# Altium schematic sheet DIOT_CONN.SchDoc
size A3; SheetNumber: 2; SheetTotal: 7
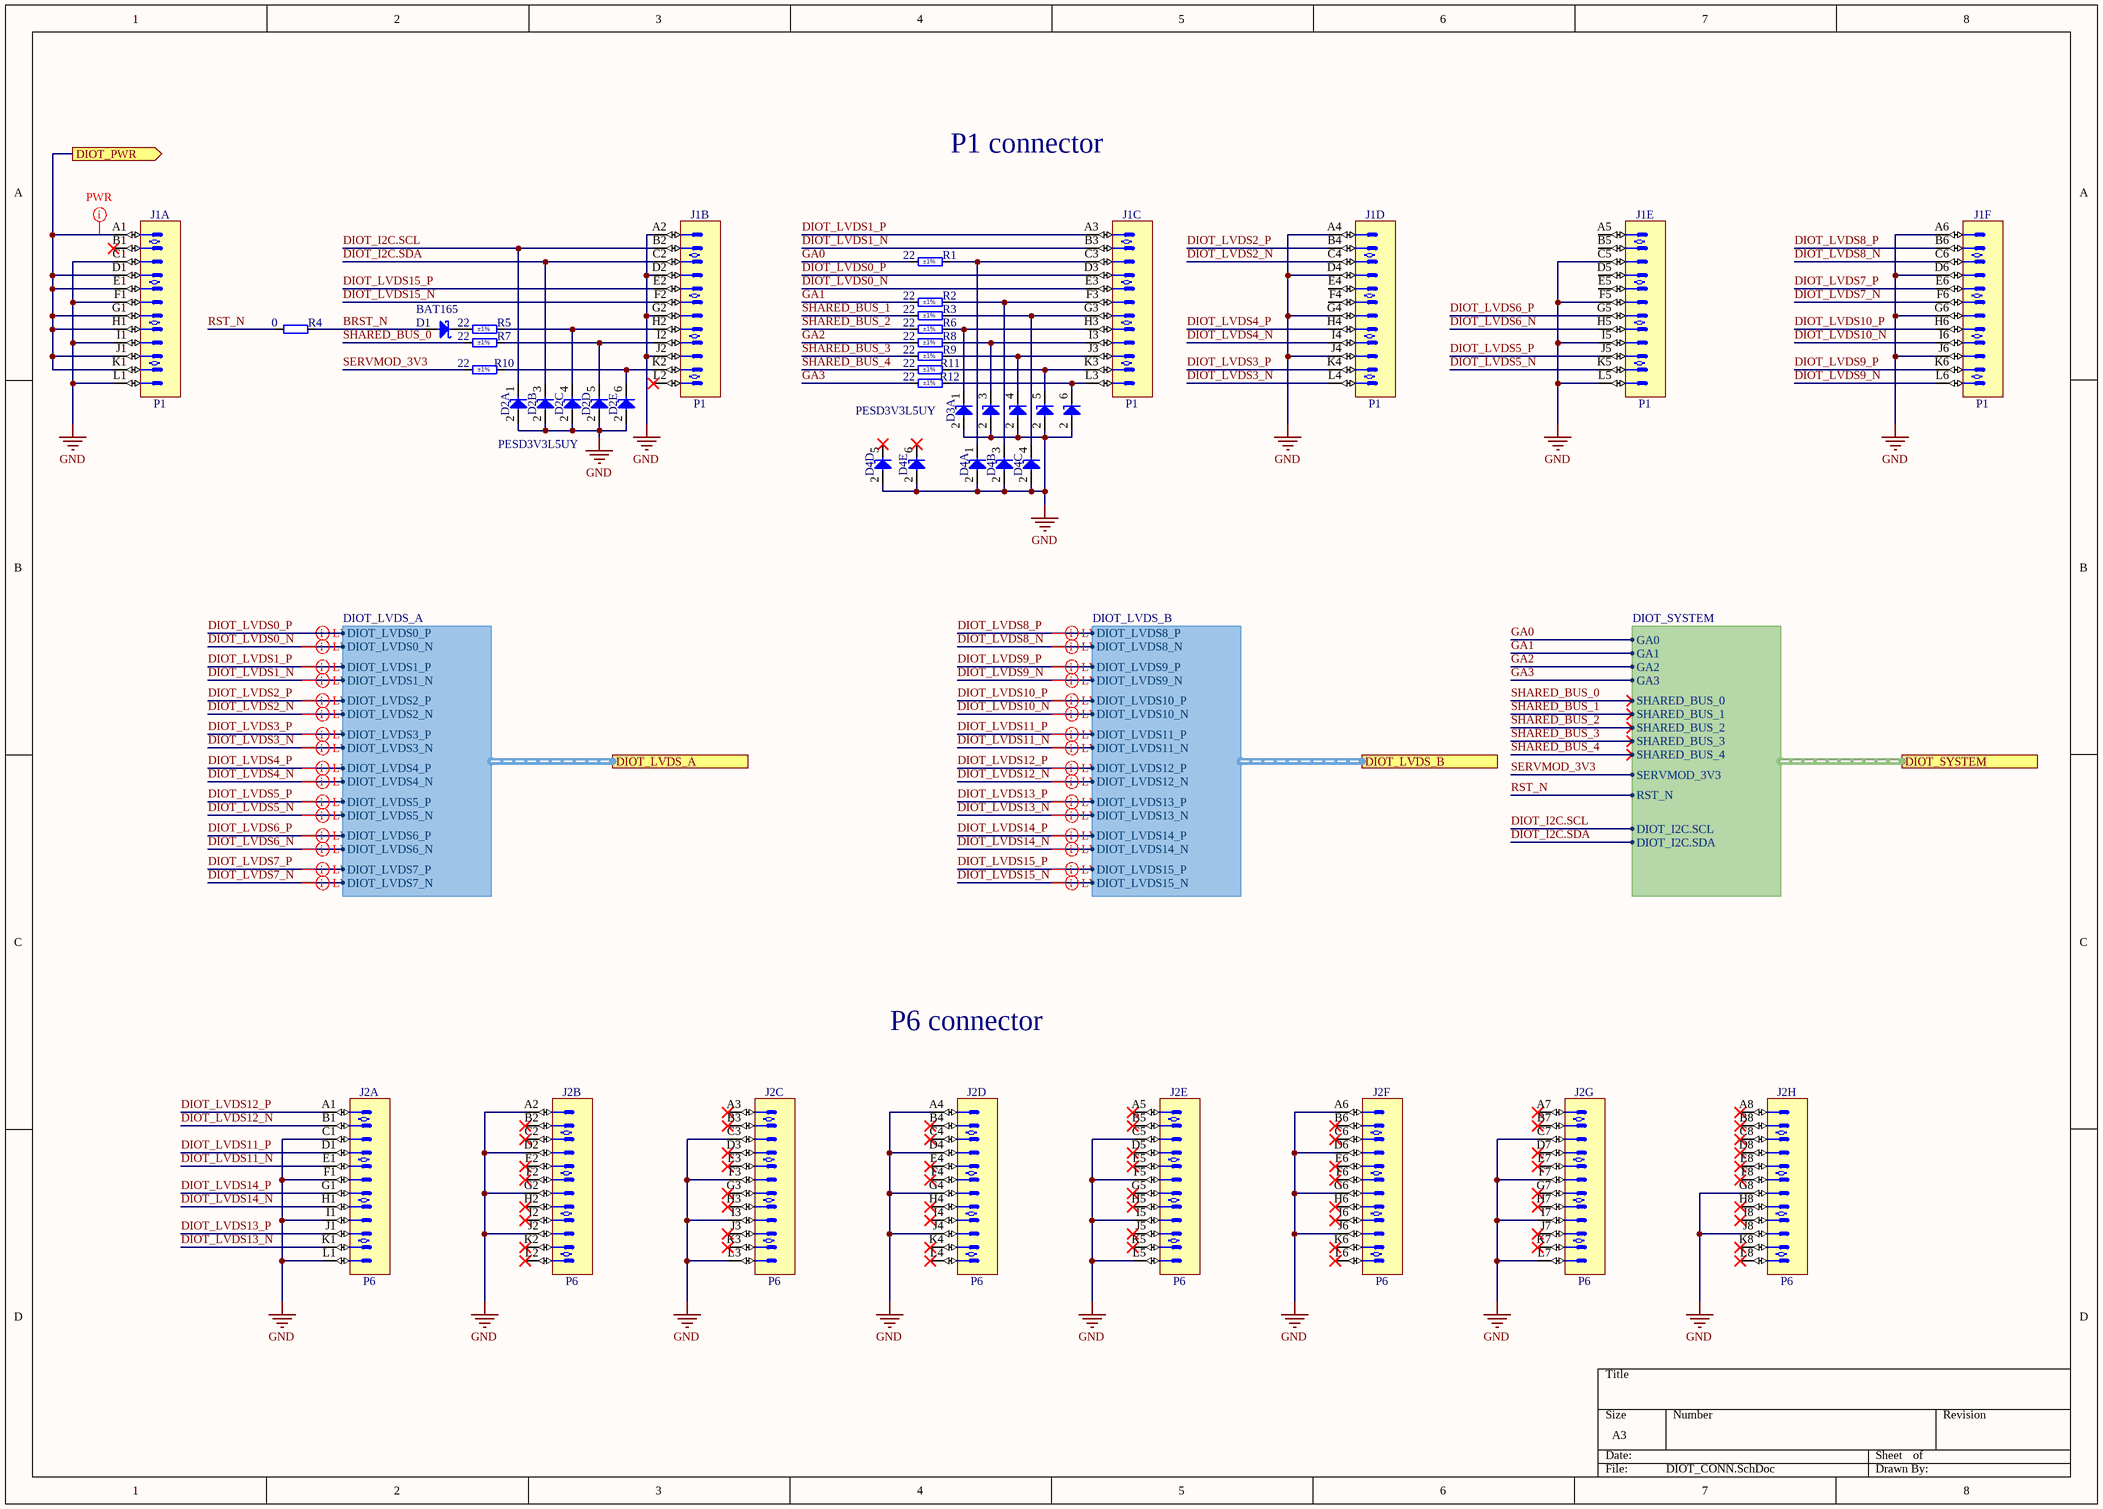
[diagram p0: DIOT_CONN.SchDoc]

## Parts
D1  BAT165  [SOD2512X110N]
D2  PESD3V3L5UY  [SOT65P210X110-6N]  (parts A,B,C,D,E of 5)
D3  PESD3V3L5UY  [SOT65P210X110-6N]  (parts A,B,C,D,E of 5)
D4  PESD3V3L5UY  [SOT65P210X110-6N]  (value not drawn)  (parts A,B,C,D,E of 5)
J1  P1  [AMPHENOL_10052825-101LF]  (parts A,B,C,D,E,F of 6)
J2  P6  [AMPHENOL_10052838-101LF]  (parts A,B,C,D,E,F,G,H of 8)
R1  22  Tolerance: ±1%  [RESC1005X40N]
R2  22  Tolerance: ±1%  [RESC1005X40N]
R3  22  Tolerance: ±1%  [RESC1005X40N]
R4  0  [RESC1005X40N]
R5  22  Tolerance: ±1%  [RESC1005X40N]
R6  22  Tolerance: ±1%  [RESC1005X40N]
R7  22  Tolerance: ±1%  [RESC1005X40N]
R8  22  Tolerance: ±1%  [RESC1005X40N]
R9  22  Tolerance: ±1%  [RESC1005X40N]
R10  22  Tolerance: ±1%  [RESC1005X40N]
R11  22  Tolerance: ±1%  [RESC1005X40N]
R12  22  Tolerance: ±1%  [RESC1005X40N]

## Ports
DIOT_LVDS_A (harness DIOT_LVDS_A, see BLOCK_DIAGRAM[6A], REDRIVERS[1A]), DIOT_LVDS_B (harness DIOT_LVDS_B, see BLOCK_DIAGRAM[6A], REDRIVERS[1B]), DIOT_PWR (out, see BLOCK_DIAGRAM[6B], PSU[1A], PSU[1D]), DIOT_SYSTEM (harness DIOT_SYSTEM, see BLOCK_DIAGRAM[7B], SYSTEM[1A])

## Harnesses
DIOT_SYSTEM: GA0, GA1, GA2, GA3, SHARED_BUS_0, SHARED_BUS_1, SHARED_BUS_2, SHARED_BUS_3, SHARED_BUS_4, SERVMOD_3V3, RST_N, DIOT_I2C.SCL, DIOT_I2C.SDA
DIOT_LVDS_A: DIOT_LVDS0_P, DIOT_LVDS0_N, DIOT_LVDS1_P, DIOT_LVDS1_N, DIOT_LVDS2_P, DIOT_LVDS2_N, DIOT_LVDS3_P, DIOT_LVDS3_N, DIOT_LVDS4_P, DIOT_LVDS4_N, DIOT_LVDS5_P, DIOT_LVDS5_N, DIOT_LVDS6_P, DIOT_LVDS6_N, DIOT_LVDS7_P, DIOT_LVDS7_N
DIOT_LVDS_B: DIOT_LVDS8_P, DIOT_LVDS8_N, DIOT_LVDS9_P, DIOT_LVDS9_N, DIOT_LVDS10_P, DIOT_LVDS10_N, DIOT_LVDS11_P, DIOT_LVDS11_N, DIOT_LVDS12_P, DIOT_LVDS12_N, DIOT_LVDS13_P, DIOT_LVDS13_N, DIOT_LVDS14_P, DIOT_LVDS14_N, DIOT_LVDS15_P, DIOT_LVDS15_N

## Nets
GND: D2.2(A) D3.2(A) D4.2(A) J1.A2 J1.A4 J1.A6 J1.C1 J1.C5 J1.D2 J1.D4 J1.D6 J1.F1 J1.F5 J1.G2 J1.G4 J1.G6 J1.I1 J1.I5 J1.J2 J1.J4 J1.J6 J1.L1 J1.L5 J2.A2 J2.A4 J2.A6 J2.C1 J2.C3 J2.C5 J2.C7 J2.D2 J2.D4 J2.D6 J2.F1 J2.F3 J2.F5 J2.F7 J2.G2 J2.G4 J2.G6 J2.G8 J2.I1 J2.I3 J2.I5 J2.I7 J2.J2 J2.J4 J2.J6 J2.J8 J2.L1 J2.L3 J2.L5 J2.L7
BRST_N: D1.2(A) R4.2
DIOT_I2C.SCL: D2.1(C) J1.B2 ; port DIOT_SYSTEM.DIOT_I2C.SCL
DIOT_I2C.SDA: D2.3(C) J1.C2 ; port DIOT_SYSTEM.DIOT_I2C.SDA
DIOT_LVDS0_N: J1.E3 ; port DIOT_LVDS_A.DIOT_LVDS0_N
DIOT_LVDS0_P: J1.D3 ; port DIOT_LVDS_A.DIOT_LVDS0_P
DIOT_LVDS1_N: J1.B3 ; port DIOT_LVDS_A.DIOT_LVDS1_N
DIOT_LVDS1_P: J1.A3 ; port DIOT_LVDS_A.DIOT_LVDS1_P
DIOT_LVDS2_N: J1.C4 ; port DIOT_LVDS_A.DIOT_LVDS2_N
DIOT_LVDS2_P: J1.B4 ; port DIOT_LVDS_A.DIOT_LVDS2_P
DIOT_LVDS3_N: J1.L4 ; port DIOT_LVDS_A.DIOT_LVDS3_N
DIOT_LVDS3_P: J1.K4 ; port DIOT_LVDS_A.DIOT_LVDS3_P
DIOT_LVDS4_N: J1.I4 ; port DIOT_LVDS_A.DIOT_LVDS4_N
DIOT_LVDS4_P: J1.H4 ; port DIOT_LVDS_A.DIOT_LVDS4_P
DIOT_LVDS5_N: J1.K5 ; port DIOT_LVDS_A.DIOT_LVDS5_N
DIOT_LVDS5_P: J1.J5 ; port DIOT_LVDS_A.DIOT_LVDS5_P
DIOT_LVDS6_N: J1.H5 ; port DIOT_LVDS_A.DIOT_LVDS6_N
DIOT_LVDS6_P: J1.G5 ; port DIOT_LVDS_A.DIOT_LVDS6_P
DIOT_LVDS7_N: J1.F6 ; port DIOT_LVDS_A.DIOT_LVDS7_N
DIOT_LVDS7_P: J1.E6 ; port DIOT_LVDS_A.DIOT_LVDS7_P
DIOT_LVDS8_N: J1.C6 ; port DIOT_LVDS_B.DIOT_LVDS8_N
DIOT_LVDS8_P: J1.B6 ; port DIOT_LVDS_B.DIOT_LVDS8_P
DIOT_LVDS9_N: J1.L6 ; port DIOT_LVDS_B.DIOT_LVDS9_N
DIOT_LVDS9_P: J1.K6 ; port DIOT_LVDS_B.DIOT_LVDS9_P
DIOT_LVDS10_N: J1.I6 ; port DIOT_LVDS_B.DIOT_LVDS10_N
DIOT_LVDS10_P: J1.H6 ; port DIOT_LVDS_B.DIOT_LVDS10_P
DIOT_LVDS11_N: J2.E1 ; port DIOT_LVDS_B.DIOT_LVDS11_N
DIOT_LVDS11_P: J2.D1 ; port DIOT_LVDS_B.DIOT_LVDS11_P
DIOT_LVDS12_N: J2.B1 ; port DIOT_LVDS_B.DIOT_LVDS12_N
DIOT_LVDS12_P: J2.A1 ; port DIOT_LVDS_B.DIOT_LVDS12_P
DIOT_LVDS13_N: J2.K1 ; port DIOT_LVDS_B.DIOT_LVDS13_N
DIOT_LVDS13_P: J2.J1 ; port DIOT_LVDS_B.DIOT_LVDS13_P
DIOT_LVDS14_N: J2.H1 ; port DIOT_LVDS_B.DIOT_LVDS14_N
DIOT_LVDS14_P: J2.G1 ; port DIOT_LVDS_B.DIOT_LVDS14_P
DIOT_LVDS15_N: J1.F2 ; port DIOT_LVDS_B.DIOT_LVDS15_N
DIOT_LVDS15_P: J1.E2 ; port DIOT_LVDS_B.DIOT_LVDS15_P
DIOT_PWR: J1.A1 J1.D1 J1.E1 J1.G1 J1.H1 J1.J1 J1.K1 ; port DIOT_PWR
GA0: R1.1 ; port DIOT_SYSTEM.GA0
GA1: R2.1 ; port DIOT_SYSTEM.GA1
GA2: R8.1 ; port DIOT_SYSTEM.GA2
GA3: R12.1 ; port DIOT_SYSTEM.GA3
RST_N: R4.1 ; port DIOT_SYSTEM.RST_N
SERVMOD_3V3: R10.1 ; port DIOT_SYSTEM.SERVMOD_3V3
SHARED_BUS_0: R7.1 ; port DIOT_SYSTEM.SHARED_BUS_0
SHARED_BUS_1: R3.1 ; port DIOT_SYSTEM.SHARED_BUS_1
SHARED_BUS_2: R6.1 ; port DIOT_SYSTEM.SHARED_BUS_2
SHARED_BUS_3: R9.1 ; port DIOT_SYSTEM.SHARED_BUS_3
SHARED_BUS_4: R11.1 ; port DIOT_SYSTEM.SHARED_BUS_4
NetD1_1: D1.1(C) R5.1
NetD2_4: D2.4(C) J1.H2 R5.2
NetD2_5: D2.5(C) J1.I2 R7.2
NetD2_6: D2.6(C) J1.K2 R10.2
NetD3_1: D3.1(C) J1.H3 R6.2
NetD3_3: D3.3(C) J1.I3 R8.2
NetD3_4: D3.4(C) J1.J3 R9.2
NetD3_5: D3.5(C) J1.K3 R11.2
NetD3_6: D3.6(C) J1.L3 R12.2
NetD4_1: D4.1(C) J1.C3 R1.2
NetD4_3: D4.3(C) J1.F3 R2.2
NetD4_4: D4.4(C) J1.G3 R3.2

Not connected (* = marked no-connect by the designer): D4 5(C)* 6(C)*; J1 A5 B1* B5 D5 E4 E5 F4 L2*; J2 A3* A5* A7* A8* B2* B3* B4* B5* B6* B7* B8* C2* C4* C6* C8* D3* D5* D7* D8* E2* E3* E4* E5* E6* E7* E8* F2* F4* F6* F8* G3* G5* G7* H2* H3* H4* H5* H6* H7* H8* I2* I4* I6* I8* J3* J5* J7* K2* K3* K4* K5* K6* K7* K8* L2* L4* L6* L8*

## Layout directives
net class PWR: DIOT_PWR
differential pair; net class LVDS; differential pair class LVDS_DIFF: DIOT_LVDS0_N, DIOT_LVDS0_P, DIOT_LVDS1_N, DIOT_LVDS1_P, DIOT_LVDS2_N, DIOT_LVDS2_P, DIOT_LVDS3_N, DIOT_LVDS3_P, DIOT_LVDS4_N, DIOT_LVDS4_P, DIOT_LVDS5_N, DIOT_LVDS5_P, DIOT_LVDS6_N, DIOT_LVDS6_P, DIOT_LVDS7_N, DIOT_LVDS7_P, DIOT_LVDS8_N, DIOT_LVDS8_P, DIOT_LVDS9_N, DIOT_LVDS9_P, DIOT_LVDS10_N, DIOT_LVDS10_P, DIOT_LVDS11_N, DIOT_LVDS11_P, DIOT_LVDS12_N, DIOT_LVDS12_P, DIOT_LVDS13_N, DIOT_LVDS13_P, DIOT_LVDS14_N, DIOT_LVDS14_P, DIOT_LVDS15_N, DIOT_LVDS15_P

## Notes on the sheet
- P1 connector
- P6 connector

## Library data of the parts
D1 = BAT165: Schottky Diode; Part Description: Medium Power AF Schottky Diode; Manufacturer: INFINEON; Voltage: 40V; Power: 750mA; PressFit: No; Bonding: No; Part Number: BAT165; Component Kind: Standard; Component Type: Standard; Device: BAT165; PackageDescription: Small Outline Diode (SOD-323), 1.70mm W X 1.25mm L X 1.10mm H body,  IPC Medium Density; Manufacturer Part Number: BAT165; Pin Count: 2; Case: SOD-323; Mounted: Yes; Socket: No; SMD: Yes; Sense: No; ComponentHeight: 1.1mm; HelpURL: \\cern.ch\dfs\Applications\Altium\Datasheets\BAT165.pdf; Author: CERN DEM JLC; CreateDate: 12.11.2014; LatestRevisionDate: 12.11.2014
D2-D4 = PESD3V3L5UY: Fivefold ESD Protection Diode Arrays; Part Description: Fivefold ESD Protection Diode Arrays (30kV); Manufacturer: NEXPERIA; Voltage: 3.3V; Power: 200W; PressFit: No; Bonding: No; Part Number: PESD3V3L5UY; Component Kind: Standard; Component Type: Standard; Device: PESD3V3L5UY; PackageDescription: SOT363, SC-88, 0.65mm Pitch; 6 Pin, 1.25mm W X 2.00mm L X 1.10mm H body, IPC Medium Density; Manufacturer Part Number: PESD3V3L5UY; Pin Count: 6; Case: SOT363; Mounted: Yes; Socket: No; SMD: Yes; Sense: No; ComponentHeight: 1.1mm; HelpURL: \\cern.ch\dfs\Applications\Altium\Datasheets\PESD3V3L5UY.pdf; Author: CERN DEM WB; CreateDate: 05.07.2021; LatestRevisionDate: 05.07.2021
J1 = AMPHENOL_10052825-101LF: 72 Contacts Header, 6 Columns, 4 Pairs per Column; Part Description: 72 Contacts, 2mm Pitch, 6 Columns, 4 Pairs per Column, 4 Walls, Right Angle Header; Part Number: AMPHENOL_10052825-101LF; Component Kind: Standard; Component Type: Standard; Pin Count: 72; Family: AirMax VS; Mounted: Yes; Socket: No; SMD: No; PressFit: Yes; Sense: No; Status: None; Manufacturer: AMPHENOL; Manufacturer Part Number: 10052825-101LF; ComponentHeight: 15.35mm; HelpURL: \\cern.ch\dfs\Applications\Altium\Datasheets\AMPHENOL_10052825-101LF.pdf; ComponentLink1URL: \\cern.ch\dfs\Applications\Altium\Datasheets\AMPHENOL_10052825-101LF_Application.pdf; ComponentLink1Description: Application; Author: CERN DEM MR; CreateDate: 19/02/2018; LatestRevisionDate: 19/02/2018; Classname: Overlapping
J2 = AMPHENOL_10052838-101LF: 96 Contacts Header, 8 Columns, 4 Pairs per Column; Part Description: 96 Contacts, 2mm Pitch, 8 Columns, 4 Pairs per Column, 4 Walls, Right Angle Header; Part Number: AMPHENOL_10052838-101LF; Component Kind: Standard; Component Type: Standard; Pin Count: 96; Family: AirMax VS; Mounted: Yes; Socket: No; SMD: No; PressFit: Yes; Sense: No; Status: None; Manufacturer: AMPHENOL; Manufacturer Part Number: 10052838-101LF; ComponentHeight: 15.35mm; HelpURL: \\cern.ch\dfs\Applications\Altium\Datasheets\AMPHENOL_10052838-101LF.pdf; ComponentLink1URL: \\cern.ch\dfs\Applications\Altium\Datasheets\AMPHENOL_10052838-101LF_Application.pdf; ComponentLink1Description: Application; Author: CERN DEM MR; CreateDate: 19.02.2018; LatestRevisionDate: 19.02.2018
R1-R3 R5-R12 = R0402_22R_1%_0.0625W_100PPM: Resistor - 1%; Part Description: General Purpose Thick Film Chip Resistor; Manufacturer: GENERIC; Manufacturer1 Part Number: 232270672209L; TC: ±100ppm/°C; PressFit: No; Part Number: R0402_22R_1%_0.0625W_100PPM; Component Kind: Standard; Component Type: Standard; Pin Count: 2; Value: 22; Status: Not Recommended; Power: 0.0625W; Manufacturer Part Number: R0402_22R_1%_0.0625W_100PPM; Case: 0402; Mounted: Yes; Sense: No; Socket: No; SMD: Yes; Manufacturer1 Example: YAGEO PHYCOMP; Manufacturer1 ComponentHeight: 0.4mm; HelpURL: \\cern.ch\dfs\Applications\Altium\Datasheets\R0402_Phycomp_RC0402.pdf; Author: CERN DEM JLC; CreateDate: 03.12.2007; LatestRevisionDate: 17.10.2012
R4 = R0402_0R_JUMPER: Resistor; Part Description: 1A (0.05R Max DC Resistance) Zero Ohm Jumper; Manufacturer: GENERIC; Manufacturer1 Part Number: 232270591001L; PressFit: No; Part Number: R0402_0R_JUMPER; Component Kind: Standard; Component Type: Standard; Pin Count: 2; Value: 0; Status: Not Recommended; Manufacturer Part Number: R0402_0R_JUMPER; Case: 0402; Mounted: Yes; Sense: No; Socket: No; SMD: Yes; Manufacturer1 Example: YAGEO PHYCOMP; Manufacturer1 ComponentHeight: 0.4mm; HelpURL: \\cern.ch\dfs\Applications\Altium\Datasheets\R0402_Phycomp_RC0402.pdf; Author: CERN DEM JLC; CreateDate: 03.12.2007; LatestRevisionDate: 17.10.2012